# EAGLE design 477breakout (EAGLE 8.0.0)
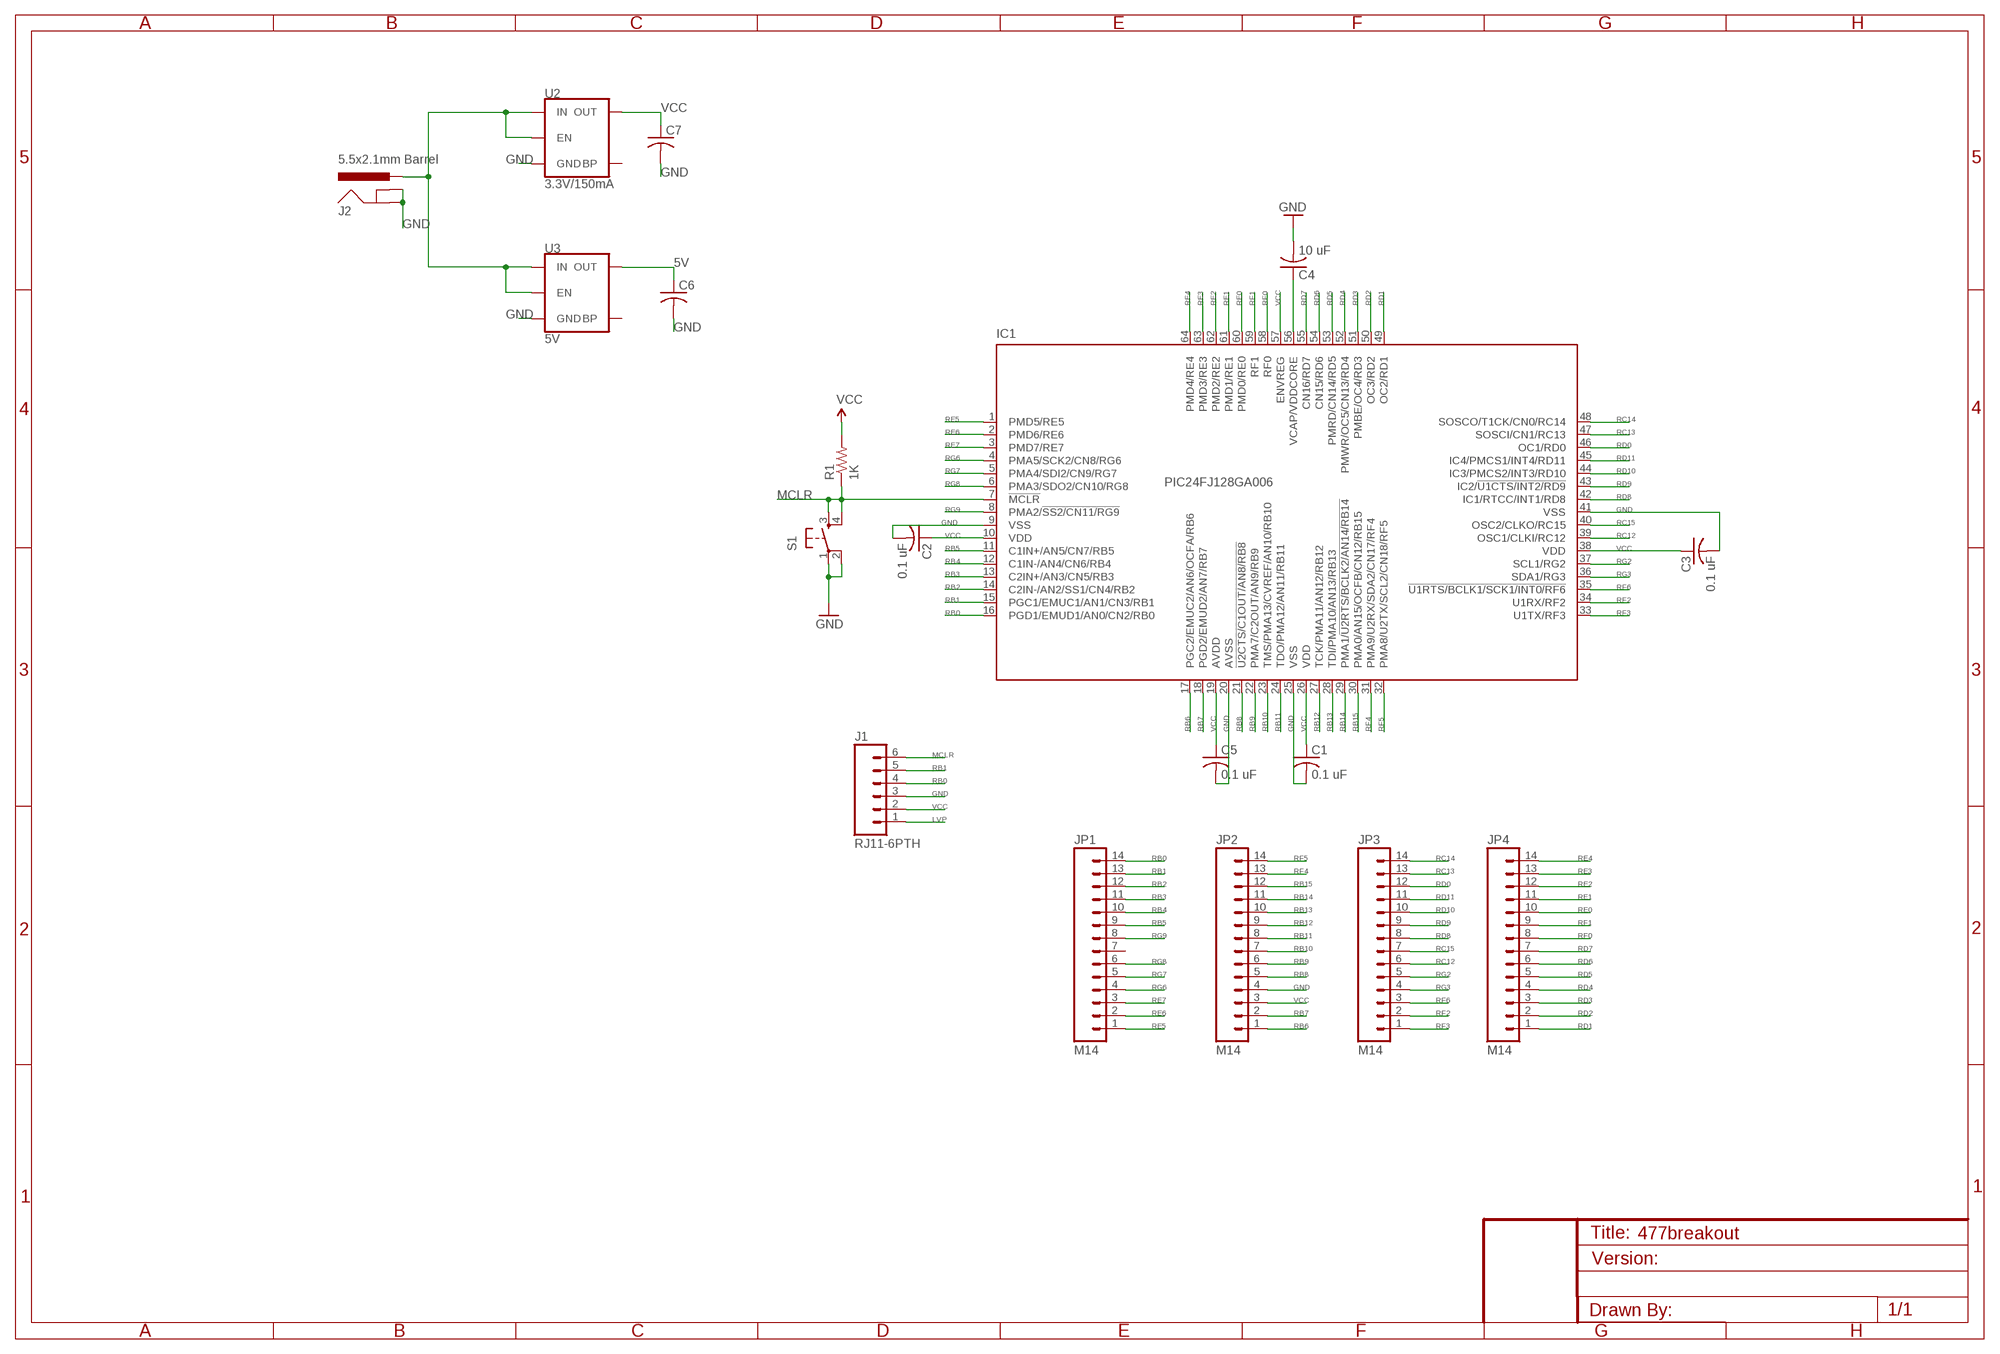
[diagram p0: schematic, sheet 1]

## Parts
C1  0.1 uF  C-USC0402  [C0402]
C2  0.1 uF  C-USC0402  [C0402]
C3  0.1 uF  C-USC0402  [C0402]
C4  10 uF  C-USC0805  [C0805]
C5  0.1 uF  C-USC0402  [C0402]
C6  C-USC1206  [C1206]
C7  C-USC1206  [C1206]
IC1  PIC24FJ128GA006  [TQFP64-10X10]
J1  RJ11-6PTH  [RJ11-6]
J2  5.5x2.1mm Barrel  POWER_JACKSMD  [POWER_JACK_SMD]
JP1  M14  [1X14]
JP2  M14  [1X14]
JP3  M14  [1X14]
JP4  M14  [1X14]
R1  1K  R-US_0204/7  [0204/7]
S1  TAC_SWITCHPTH  [TACTILE-PTH]
U2  3.3V/150mA  V_REG_MIC52053.3V  [SOT23-5]
U3  5V  V_REG_MIC52055V  [SOT23-5]

## Nets
5V: C6.1 U3.5(OUT)
GND: C1.2 C2.2 C3.2 C4.2 C5.2 C6.2 C7.2 IC1.9(VSS) IC1.20(AVSS) IC1.25(VSS) IC1.41(VSS) J1.3 J2.GND(GNDBREAK) J2.P$4(GND) JP2.4 S1.1 S1.2 U2.2(GND) U3.2(GND)
LVP: J1.1
MCLR: IC1.7(!MCLR) J1.6 R1.1 S1.3 S1.4
N$1: C4.1 IC1.56(VCAP/VDDCORE)
N$2: J2.VIN0(PWR) U2.1(IN) U2.3(EN) U3.1(IN) U3.3(EN)
RB0: IC1.16(PGD1/EMUD1/AN0/CN2/RB0) J1.4 JP1.14
RB1: IC1.15(PGC1/EMUC1/AN1/CN3/RB1) J1.5 JP1.13
RB2: IC1.14(C2IN-/AN2/SS1/CN4/RB2) JP1.12
RB3: IC1.13(C2IN+/AN3/CN5/RB3) JP1.11
RB4: IC1.12(C1IN-/AN4/CN6/RB4) JP1.10
RB5: IC1.11(C1IN+/AN5/CN7/RB5) JP1.9
RB6: IC1.17(PGC2/EMUC2/AN6/OCFA/RB6) JP2.1
RB7: IC1.18(PGD2/EMUD2/AN7/RB7) JP2.2
RB8: IC1.21(!U2CTS/C1OUT/AN8/RB8) JP2.5
RB9: IC1.22(PMA7/C2OUT/AN9/RB9) JP2.6
RB10: IC1.23(TMS/PMA13/CVREF/AN10/RB10) JP2.7
RB11: IC1.24(TDO/PMA12/AN11/RB11) JP2.8
RB12: IC1.27(TCK/PMA11/AN12/RB12) JP2.9
RB13: IC1.28(TDI/PMA10/AN13/RB13) JP2.10
RB14: IC1.29(PMA1/!U2RTS/BCLK2/AN14/RB14) JP2.11
RB15: IC1.30(PMA0/AN15/OCFB/CN12/RB15) JP2.12
RC12: IC1.39(OSC1/CLKI/RC12) JP3.6
RC13: IC1.47(SOSCI/CN1/RC13) JP3.13
RC14: IC1.48(SOSCO/T1CK/CN0/RC14) JP3.14
RC15: IC1.40(OSC2/CLKO/RC15) JP3.7
RD0: IC1.46(OC1/RD0) JP3.12
RD1: IC1.49(OC2/RD1) JP4.1
RD2: IC1.50(OC3/RD2) JP4.2
RD3: IC1.51(PMBE/OC4/RD3) JP4.3
RD4: IC1.52(PMWR/OC5/CN13/RD4) JP4.4
RD5: IC1.53(PMRD/CN14/RD5) JP4.5
RD6: IC1.54(CN15/RD6) JP4.6
RD7: IC1.55(CN16/RD7) JP4.7
RD8: IC1.42(IC1/RTCC/INT1/RD8) JP3.8
RD9: IC1.43(IC2/!U1CTS/INT2/RD9) JP3.9
RD10: IC1.44(IC3/PMCS2/INT3/RD10) JP3.10
RD11: IC1.45(IC4/PMCS1/INT4/RD11) JP3.11
RE0: IC1.60(PMD0/RE0) JP4.10
RE1: IC1.61(PMD1/RE1) JP4.11
RE2: IC1.62(PMD2/RE2) JP4.12
RE3: IC1.63(PMD3/RE3) JP4.13
RE4: IC1.64(PMD4/RE4) JP4.14
RE5: IC1.1(PMD5/RE5) JP1.1
RE6: IC1.2(PMD6/RE6) JP1.2
RE7: IC1.3(PMD7/RE7) JP1.3
RF0: IC1.58(RF0) JP4.8
RF1: IC1.59(RF1) JP4.9
RF2: IC1.34(U1RX/RF2) JP3.2
RF3: IC1.33(U1TX/RF3) JP3.1
RF4: IC1.31(PMA9/U2RX/SDA2/CN17/RF4) JP2.13
RF5: IC1.32(PMA8/U2TX/SCL2/CN18/RF5) JP2.14
RF6: IC1.35(!U1RTS/BCLK1/SCK1/INT0/RF6) JP3.3
RG2: IC1.37(SCL1/RG2) JP3.5
RG3: IC1.36(SDA1/RG3) JP3.4
RG6: IC1.4(PMA5/SCK2/CN8/RG6) JP1.4
RG7: IC1.5(PMA4/SDI2/CN9/RG7) JP1.5
RG8: IC1.6(PMA3/SDO2/CN10/RG8) JP1.6
RG9: IC1.8(PMA2/!SS2/CN11/RG9) JP1.8
VCC: C1.1 C2.1 C3.1 C5.1 C7.1 IC1.10(VDD) IC1.19(AVDD) IC1.26(VDD) IC1.38(VDD) IC1.57(ENVREG) J1.2 JP2.3 R1.2 U2.5(OUT)
Unconnected: JP1.7 U2.4(BP) U3.4(BP)

## Library data of the parts
C1-C7 = rcl:C-US: CAPACITOR, American symbol
IC1 = microchip:PIC24FJ*GA006: 64/80/100-Pin General Purpose, 16-Bit Flash Microcontrollers Source: http://ww1.microchip.com/downloads/en/DeviceDoc/39747d.pdf; MF: MICROCHIP; MPN: PIC24FJ128GA006-I/PT; OC_FARNELL: 1146519; OC_NEWARK: 56K7337
J1 = SparkFun:RJ11-6: RJ11 Jack Simple 6 pin RJ11 jack. Commonly found on CAT3 devices and Microchip programmers. SKU: PRT-00132
J2 = SparkFun-Connectors:POWER_JACK: Power Jack Connector This is the standard 5.5mm barrel jack for power. The PTH is the most common, proven, reliable, footprint. The Slot footprint only works if the mill layer is transmitted to the PCB fab house so be warned. Here are the connectors we sell at SparkFun: DC Barrel Power Jack/Connector <https://www.sparkfun.com/products/119> (PRT-00119) DC Barrel Power Jack/Connector (SMD) <https://www.sparkfun.com/products/12748> (PRT-12748) DC Barrel Jack Adapter - Breadboard Compatible <https://www.sparkfun.com/products/10811> (PRT-10811) It is used on this SparkFun product (and many, many others): SparkFun RedBoard - Programmed with Arduino <https://www.sparkfun.com/products/12757> (DEV-12757) Also, if you need a mating power supply or connector, please check these out: Wall Adapter Power Supply - 9VDC 650mA <https://www.sparkfun.com/products/298> (TOL-00298) DC Barrel Jack Adapter - Male <https://www.sparkfun.com/products/10287> (PRT-10287); PROD_ID: CONN-08106; SF_ID: PRT-12748
JP1-JP4 = SparkFun:M14: Header 14 Standard 14-pin 0.1" header. Use with straight break away headers (SKU : PRT-00116), right angle break away headers (PRT-00553), swiss pins (PRT-00743), machine pins (PRT-00117), and female headers (PRT-00115).
R1 = rcl:R-US_: RESISTOR, American symbol
S1 = SparkFun:TAC_SWITCH: Momentary Switch Button commonly used for reset or general input. Spark Fun Electronics SKU : COM-00097
U2 = SparkFun-IC-Power:V_REG_MIC5205: V_REG MIC5205 Standard 3.3V, 5V, and Adjustable 150mA LDO voltage regulator in SOT-23 layout. Micrel part MIC5205. BP (by-pass) pin is used to lower output noise with 470pF cap, may be left open. On the adjustable version BP is used to set output.; PROD_ID: VREG-00822
U3 = SparkFun-IC-Power:V_REG_MIC5205: V_REG MIC5205 Standard 3.3V, 5V, and Adjustable 150mA LDO voltage regulator in SOT-23 layout. Micrel part MIC5205. BP (by-pass) pin is used to lower output noise with 470pF cap, may be left open. On the adjustable version BP is used to set output.; PROD_ID: VREG-00823

## Board
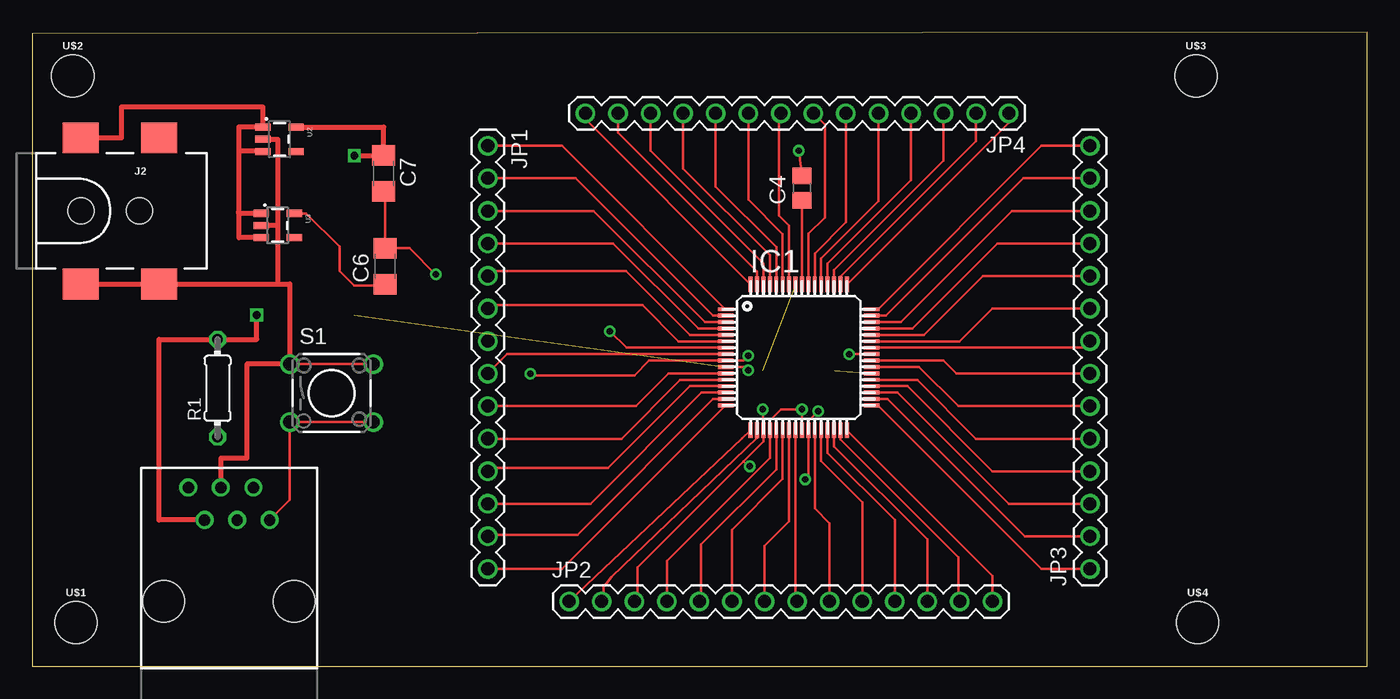
[diagram p1: board, top side]
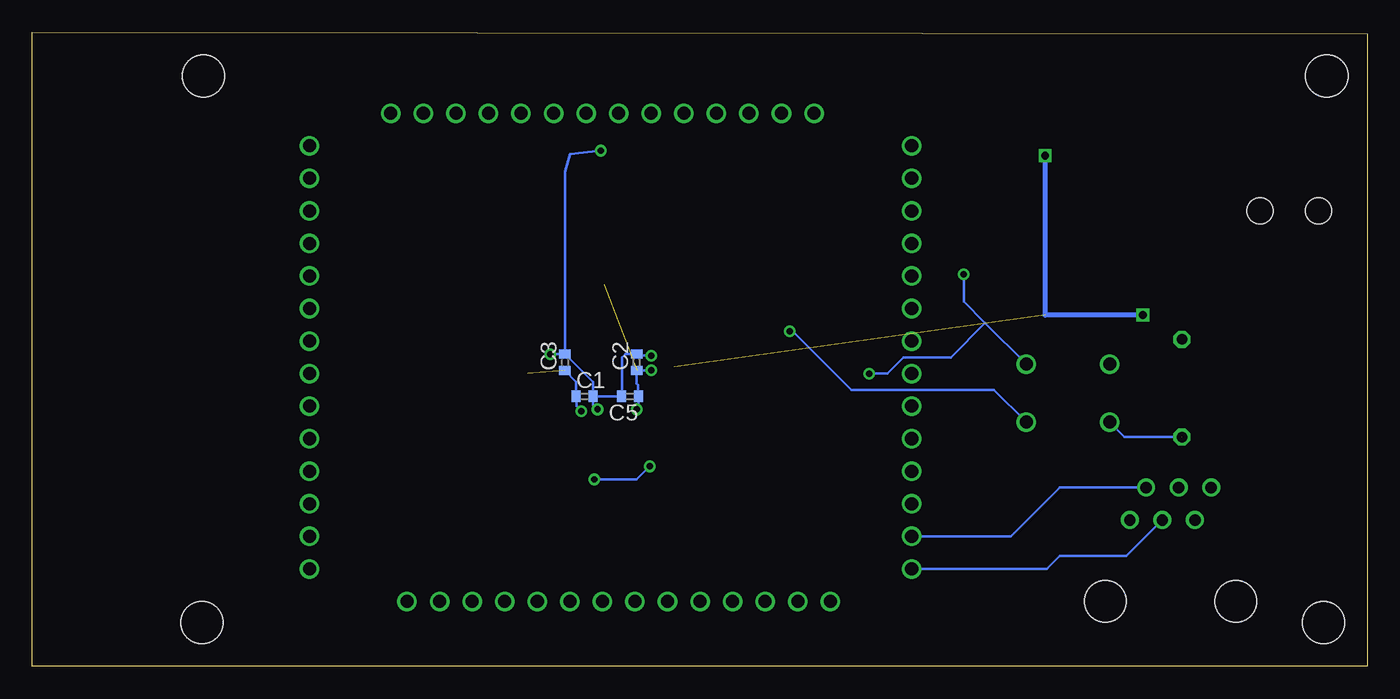
[diagram p2: board, bottom side, seen from below]

Size 104.19 x 49.52 mm. Coordinates in mm from the lower left corner, seen from the top.
Outline: 0,0 104.19,0 104.19,49.52 0,49.39 0,0
Copper layers (1*16): Top 0.035mm / dielectric 1.5mm / Bottom 0.035mm
Design rules "default": minimum track width 10mil, minimum drill 24mil, track to track 8mil, track to pad 8mil, pad to pad 8mil, via to via 8mil, smd to smd 8mil, copper to edge 40mil, drill to drill 8mil, minimum pad ring 10mil, minimum via ring 8mil, stop-mask expansion 4mil, vias tented up to drill 0mil, thermal gap 10mil

### Footprints (pad centres in the part's own frame; a part is rotated, then mirrored left to right if it is on the bottom)
C0402 = smd 0.7 x 0.9: 1 -0.65,0; 2 0.65,0
C0805 = smd 1.3 x 1.5: 1 -0.95,0; 2 0.95,0
C1206 = smd 1.6 x 1.8: 1 -1.4,0; 2 1.4,0
TQFP64-10X10 = smd 1.2 x 0.3: 1 -5.7,3.75; 2 -5.7,3.25; 3 -5.7,2.75; 4 -5.7,2.25; 5 -5.7,1.75; 6 -5.7,1.25; 7 -5.7,0.75; 8 -5.7,0.25; 9 -5.7,-0.25; 10 -5.7,-0.75; 11 -5.7,-1.25; 12 -5.7,-1.75; 13 -5.7,-2.25; 14 -5.7,-2.75; 15 -5.7,-3.25; 16 -5.7,-3.75; 33 5.7,-3.75; 34 5.7,-3.25; 35 5.7,-2.75; 36 5.7,-2.25; 37 5.7,-1.75; 38 5.7,-1.25; 39 5.7,-0.75; 40 5.7,-0.25; 41 5.7,0.25; 42 5.7,0.75; 43 5.7,1.25; 44 5.7,1.75; 45 5.7,2.25; 46 5.7,2.75; 47 5.7,3.25; 48 5.7,3.75 | smd 0.3 x 1.2: 17 -3.75,-5.7; 18 -3.25,-5.7; 19 -2.75,-5.7; 20 -2.25,-5.7; 21 -1.75,-5.7; 22 -1.25,-5.7; 23 -0.75,-5.7; 24 -0.25,-5.7; 25 0.25,-5.7; 26 0.75,-5.7; 27 1.25,-5.7; 28 1.75,-5.7; 29 2.25,-5.7; 30 2.75,-5.7; 31 3.25,-5.7; 32 3.75,-5.7; 49 3.75,5.7; 50 3.25,5.7; 51 2.75,5.7; 52 2.25,5.7; 53 1.75,5.7; 54 1.25,5.7; 55 0.75,5.7; 56 0.25,5.7; 57 -0.25,5.7; 58 -0.75,5.7; 59 -1.25,5.7; 60 -1.75,5.7; 61 -2.25,5.7; 62 -2.75,5.7; 63 -3.25,5.7; 64 -3.75,5.7
RJ11-6 = drill 0.889: 1 1.905,8.89; 2 3.175,6.35; 3 4.445,8.89; 4 5.715,6.35; 5 6.985,8.89; 6 8.255,6.35 | hole 3.251: 0,0; 10.16,0
POWER_JACK_SMD = smd 2.8 x 2.4: GND 0,-5.7; P$4 6.1,-5.7; VIN0 0,5.7; VIN1 6.1,5.7 | hole 2.032: 0,0; 4.572,0
1X14 = drill 1.016: 1 0,0; 2 2.54,0; 3 5.08,0; 4 7.62,0; 5 10.16,0; 6 12.7,0; 7 15.24,0; 8 17.78,0; 9 20.32,0; 10 22.86,0; 11 25.4,0; 12 27.94,0; 13 30.48,0; 14 33.02,0
0204/7 = drill 0.813 octagon: 1 -3.81,0; 2 3.81,0
TACTILE-PTH = drill 1.016: 1 -3.251,2.261; 2 3.251,2.261; 3 -3.251,-2.261; 4 3.251,-2.261
SOT23-5 = smd 0.55 x 1.2: 1 -0.95,-1.3; 2 0,-1.3; 3 0.95,-1.3; 4 0.95,1.3; 5 -0.95,1.3
STAND-OFF = hole 3.302: 0,0

### Placement (x,y rotation side)
C1  61.09,21.08 0 bottom
C2  57.02,23.75 90 bottom
C3  62.61,23.75 90 bottom
C4  60.07,37.34 90 top
C5  57.53,21.08 180 bottom
C6  27.56,31.24 90 top
C7  27.43,38.48 270 top
IC1  59.82,24.13 0 top
J1  10.29,5.08 0 top
J2  3.81,35.56 0 top
JP1  35.56,40.64 270 top
JP2  41.91,5.08 0 top
JP3  82.55,7.62 90 top
JP4  76.2,43.18 180 top
R1  14.48,21.72 90 top
S1  23.37,21.34 0 top
U2  19.3,41.15 270 top
U3  19.18,34.42 270 top
U$1  [STAND-OFF]  3.43,3.43 0 top
U$2  [STAND-OFF]  3.17,46.1 0 top
U$3  [STAND-OFF]  90.81,46.1 0 top
U$4  [STAND-OFF]  90.93,3.43 0 top

### Tracks (layer width: path | path; a pad name or v marks a point on that pad's centre or on a via)
5V
  Top 0.203: U3.5 21.4,35.37 24,32.77 24,30.86 25.15,29.72 27.43,29.72 C6.1
GND  (via drill 0.5)
  Top 0.203: v63.75,24.38 IC1.41 | IC1.25 v60.07,20.07 58.42,20.07 57.57,19.21 IC1.20 57.57,16.29 49.53,8.26 JP2.4 | v55.88,24.26 55.5,23.88 IC1.9 48.14,23.88 46.99,22.73 38.99,22.73 v38.86,22.86 | C4.2 v59.82,40.26 | S1.1 S1.2 | C7.2 27.56,36.95 C6.2 29.46,32.64 v31.5,30.61
  Top 0.406: 19.18,29.86 J2.P$4 J2.GND | 19.18,34.42 19.18,29.86 | 19.18,34.42 U3.2 | U2.2 19.18,41.15 19.18,34.42 | J1.3 14.73,16.26 16.76,16.26 16.76,23.6 S1.1 20.12,29.86 19.18,29.86
  Bottom 0.203: C3.2 63.74,24.4 v63.75,24.38 | C1.2 60.44,20.43 v60.07,20.07 | C1.2 C5.2 58.17,21.1 58.17,24.13 57.9,24.4 C2.2 56.88,24.26 v55.88,24.26 | C1.2 60.44,22.23 C3.2 | v59.82,40.26 62.23,40.01 62.61,38.61 C3.2 | v31.5,30.61 31.5,28.47 29.83,26.81 | 29.83,26.81 S1.2 | v38.86,22.86 37.47,22.86 36.2,24.13 32.51,24.13 29.83,26.81
MCLR  (via drill 0.5)  (1 unrouted)
  Top 0.203: S1.4 S1.3 20.12,13.01 J1.6 | IC1.7 46.37,24.88 v45.09,26.16
  Bottom 0.203: v45.09,26.16 44.83,26.16 40.26,21.59 29.13,21.59 S1.4 | R1.1 18.95,17.91 S1.3
N$1
  Top 0.203: IC1.56 60.07,33.34 C4.1
N$2
  Top 0.406: J2.VIN0 6.99,41.26 6.99,43.69 18,43.69 U2.1 16.13,42.1 16.13,40.26 | U3.3 16.13,33.47 16.13,35.56 | 16.13,40.26 16.13,35.56 | 16.13,40.26 18,40.26 U2.3 | U3.1 16.13,35.37 16.13,35.56
RB0
  Top 0.203: JP1.14 41.36,7.62 IC1.16
  Bottom 0.203: JP1.14 25.02,7.62 24,8.64 18.8,8.64 J1.4
RB1
  Top 0.203: IC1.15 53.14,20.88 42.55,10.29 35.69,10.29 JP1.13
  Bottom 0.203: JP1.13 27.81,10.16 24,13.97 J1.5
RB2
  Top 0.203: IC1.14 52.24,21.38 43.56,12.7 JP1.12
RB3
  Top 0.203: IC1.13 51.34,21.88 44.96,15.49 35.81,15.49 JP1.11
RB4
  Top 0.203: IC1.12 50.57,22.38 45.97,17.78 JP1.10
RB5
  Top 0.203: IC1.11 49.68,22.88 47.12,20.32 JP1.9
RB6
  Top 0.203: IC1.17 55.39,17.8 JP2.1
RB7
  Top 0.203: IC1.18 56.57,17.83 45.21,6.99 44.83,6.48 44.58,6.22 44.58,5.21 JP2.2
RB8
  Top 0.203: IC1.21 58.07,15.39 52.2,9.53 52.2,5.21 JP2.5
RB9
  Top 0.203: IC1.22 58.57,14.62 54.61,10.67 JP2.6
RB10
  Top 0.203: IC1.23 59.07,11.31 57.15,9.4 JP2.7
RB11
  Top 0.203: IC1.24 59.57,5.2 JP2.8
RB12
  Top 0.203: IC1.27 61.07,12.34 62.23,11.18 JP2.9
RB13
  Top 0.203: IC1.28 61.57,16.03 64.77,12.83 JP2.10
RB14
  Top 0.203: IC1.29 62.07,16.67 67.31,11.43 JP2.11
RB15
  Top 0.203: IC1.30 62.57,17.19 69.85,9.91 JP2.12
RC12
  Top 0.203: IC1.39 69.2,23.38 72.26,20.32 JP3.6
RC13
  Top 0.203: IC1.47 66.62,27.38 77.34,38.1 JP3.13
RC14
  Top 0.203: IC1.48 65.98,27.88 78.74,40.64 JP3.14
RC15
  Top 0.203: IC1.40 71.12,23.88 72.14,22.86 JP3.7
RD0
  Top 0.203: IC1.46 67.77,26.88 76.45,35.56 JP3.12
RD1
  Top 0.203: JP4.1 76.2,42.46 IC1.49
RD2
  Top 0.203: IC1.50 63.07,30.43 73.66,41.02 JP4.2
RD3
  Top 0.203: IC1.51 62.57,30.94 71.12,39.5 JP4.3
RD4
  Top 0.203: IC1.52 62.07,31.46 68.58,37.97 JP4.4
RD5
  Top 0.203: IC1.53 61.57,31.85 66.04,36.32 JP4.5
RD6
  Top 0.203: IC1.54 61.07,32.24 63.5,34.67 JP4.6
RD7
  Top 0.203: IC1.55 60.57,33.77 61.85,35.05 61.85,42.29 JP4.7
RD8
  Top 0.203: IC1.42 82.03,24.88 JP3.8
RD9
  Top 0.203: IC1.43 72.37,25.38 74.93,27.94 JP3.9
RD10
  Top 0.203: IC1.44 69.57,25.88 74.17,30.48 JP3.10
RD11
  Top 0.203: IC1.45 68.67,26.38 75.31,33.02 JP3.11
RE0
  Top 0.203: IC1.60 58.07,32.74 53.34,37.47 JP4.10
RE1
  Top 0.203: IC1.61 57.57,32.09 50.8,38.86 JP4.11
RE2
  Top 0.203: IC1.62 57.07,31.45 48.26,40.26 JP4.12
RE3
  Top 0.203: IC1.63 56.57,30.81 45.72,41.66 JP4.13
RE4
  Top 0.203: JP4.14 43.18,42.72 IC1.64
RE5
  Top 0.203: JP1.1 41.36,40.64 IC1.1
RE6
  Top 0.203: IC1.2 53.14,27.38 42.42,38.1 JP1.2
RE7
  Top 0.203: IC1.3 52.49,26.88 43.81,35.56 JP1.3
RF0
  Top 0.203: IC1.58 59.07,34.41 58.29,35.18 58.29,43.05 JP4.8
RF1
  Top 0.203: IC1.59 58.57,33.76 55.88,36.45 JP4.9
RF2
  Top 0.203: IC1.34 66.75,20.88 77.47,10.16 JP3.2
RF3
  Top 0.203: IC1.33 65.98,20.38 78.74,7.62 JP3.1
RF4
  Top 0.203: IC1.31 63.07,17.7 72.26,8.51 72.26,5.21 JP2.13
RF5
  Top 0.203: JP2.14 74.93,7.07 IC1.32
RF6
  Top 0.203: IC1.35 67.52,21.38 76.2,12.7 JP3.3
RG2
  Top 0.203: IC1.37 69.06,22.38 73.66,17.78 JP3.5
RG3
  Top 0.203: IC1.36 68.29,21.88 74.93,15.24 JP3.4
RG6
  Top 0.203: IC1.4 51.98,26.38 45.34,33.02 JP1.4
RG7
  Top 0.203: IC1.5 51.34,25.88 46.35,30.86 35.94,30.86 JP1.5
RG8
  Top 0.203: IC1.6 50.44,25.38 47.62,28.19 35.81,28.19 JP1.6
RG9
  Top 0.203: IC1.8 37.08,24.38 JP1.8
VCC  (via drill 0.5, 0.6)  (3 unrouted)
  Top 0.203: v61.34,19.94 60.57,19.16 IC1.26 60.57,14.85 v60.33,14.61 | v57.02,20.07 57.02,18.47 IC1.19 57.07,17.57 55.5,16 | IC1.10 55.61,23.38 v55.88,23.11 | 55.5,16 47.24,7.75 47.24,5.33 JP2.3 | v56.01,15.62 55.88,15.62 55.5,16
  Top 0.406: U2.5 27.43,42.1 C7.1 v25.15,39.88 | J1.2 9.91,11.43 9.91,25.53 R1.2 17.53,25.53 v17.53,27.43
  Bottom 0.203: 57.02,21.08 C5.1 | v61.34,19.94 61.72,20.32 61.72,21.07 C1.1 61.74,22.23 C3.1 | C5.1 56.9,21.1 56.9,21.97 57.02,22.1 C2.1 57.01,23.11 v55.88,23.11 | C5.1 56.88,20.21 v57.02,20.07 | v60.33,14.61 57.02,14.61 v56.01,15.62
  Bottom 0.406: v17.53,27.43 25.15,27.43 v25.15,39.88